# Altium schematic sheet BMP180气压传感器模块.SchDoc
size A4
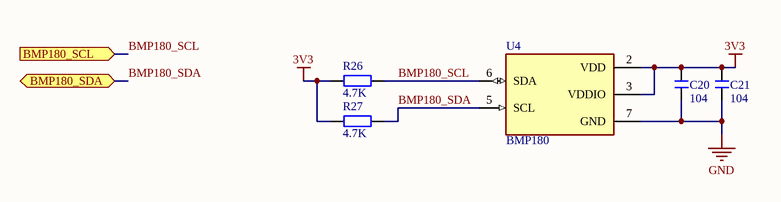
[diagram p0: BMP180气压传感器模块.SchDoc]

## Parts
C20  104  [C 0603_L]
C21  104  [C 0603_L]
R26  4.7K  [R 0603_L]
R27  4.7K  [R 0603_L]
U4  BMP180  [LGA-7]

## Ports
BMP180_SCL (in), BMP180_SDA (bidir)

## Nets
3V3: C20.2 C21.2 R26.2 R27.2 U4.2(VDD) U4.3(VDDIO)
GND: C20.1 C21.1 U4.7(GND)
BMP180_SCL: R26.1 U4.6(SDA) ; port BMP180_SCL
BMP180_SDA: R27.1 U4.5(SCL) ; port BMP180_SDA

## Library data of the parts
C20 C21 = C: 无极性贴片电容; 版权归属: 黎明电子style; BOM名称: 无极性贴片电容; 学习资源: https://lmdzstyle.taobao.com/
R26 R27 = R: 贴片电阻; 版权归属: 黎明电子style; BOM名称: 贴片电阻; 学习资源: https://lmdzstyle.taobao.com/
U4 = BMP180: 气压传感器Pressure Sensor 4.35PSI ~ 15.95PSI _30kPa ~ 110kPa_ Absolute 16 ~ 19 b 7-VLGA; MF: Bosch Sensortec; Digi-Key_Purchase_URL: https://www.digikey.com/product-detail/en/bosch-sensortec/BMP180/828-1027-1-ND/2688260?utm_source=snapeda&utm_medium=aggregator&utm_campaign=symbol; Digi-Key_Part_Number: 828-1027-1-ND; Package: VLGA-7 Bosch Sensortec; SnapEDA_Link: https://www.snapeda.com/parts/BMP180/Bosch%20Sensortec/view-part/587596/?ref=snap; Value: *; MP: BMP180